# EAGLE design 305_wifi (EAGLE 7.6.0)
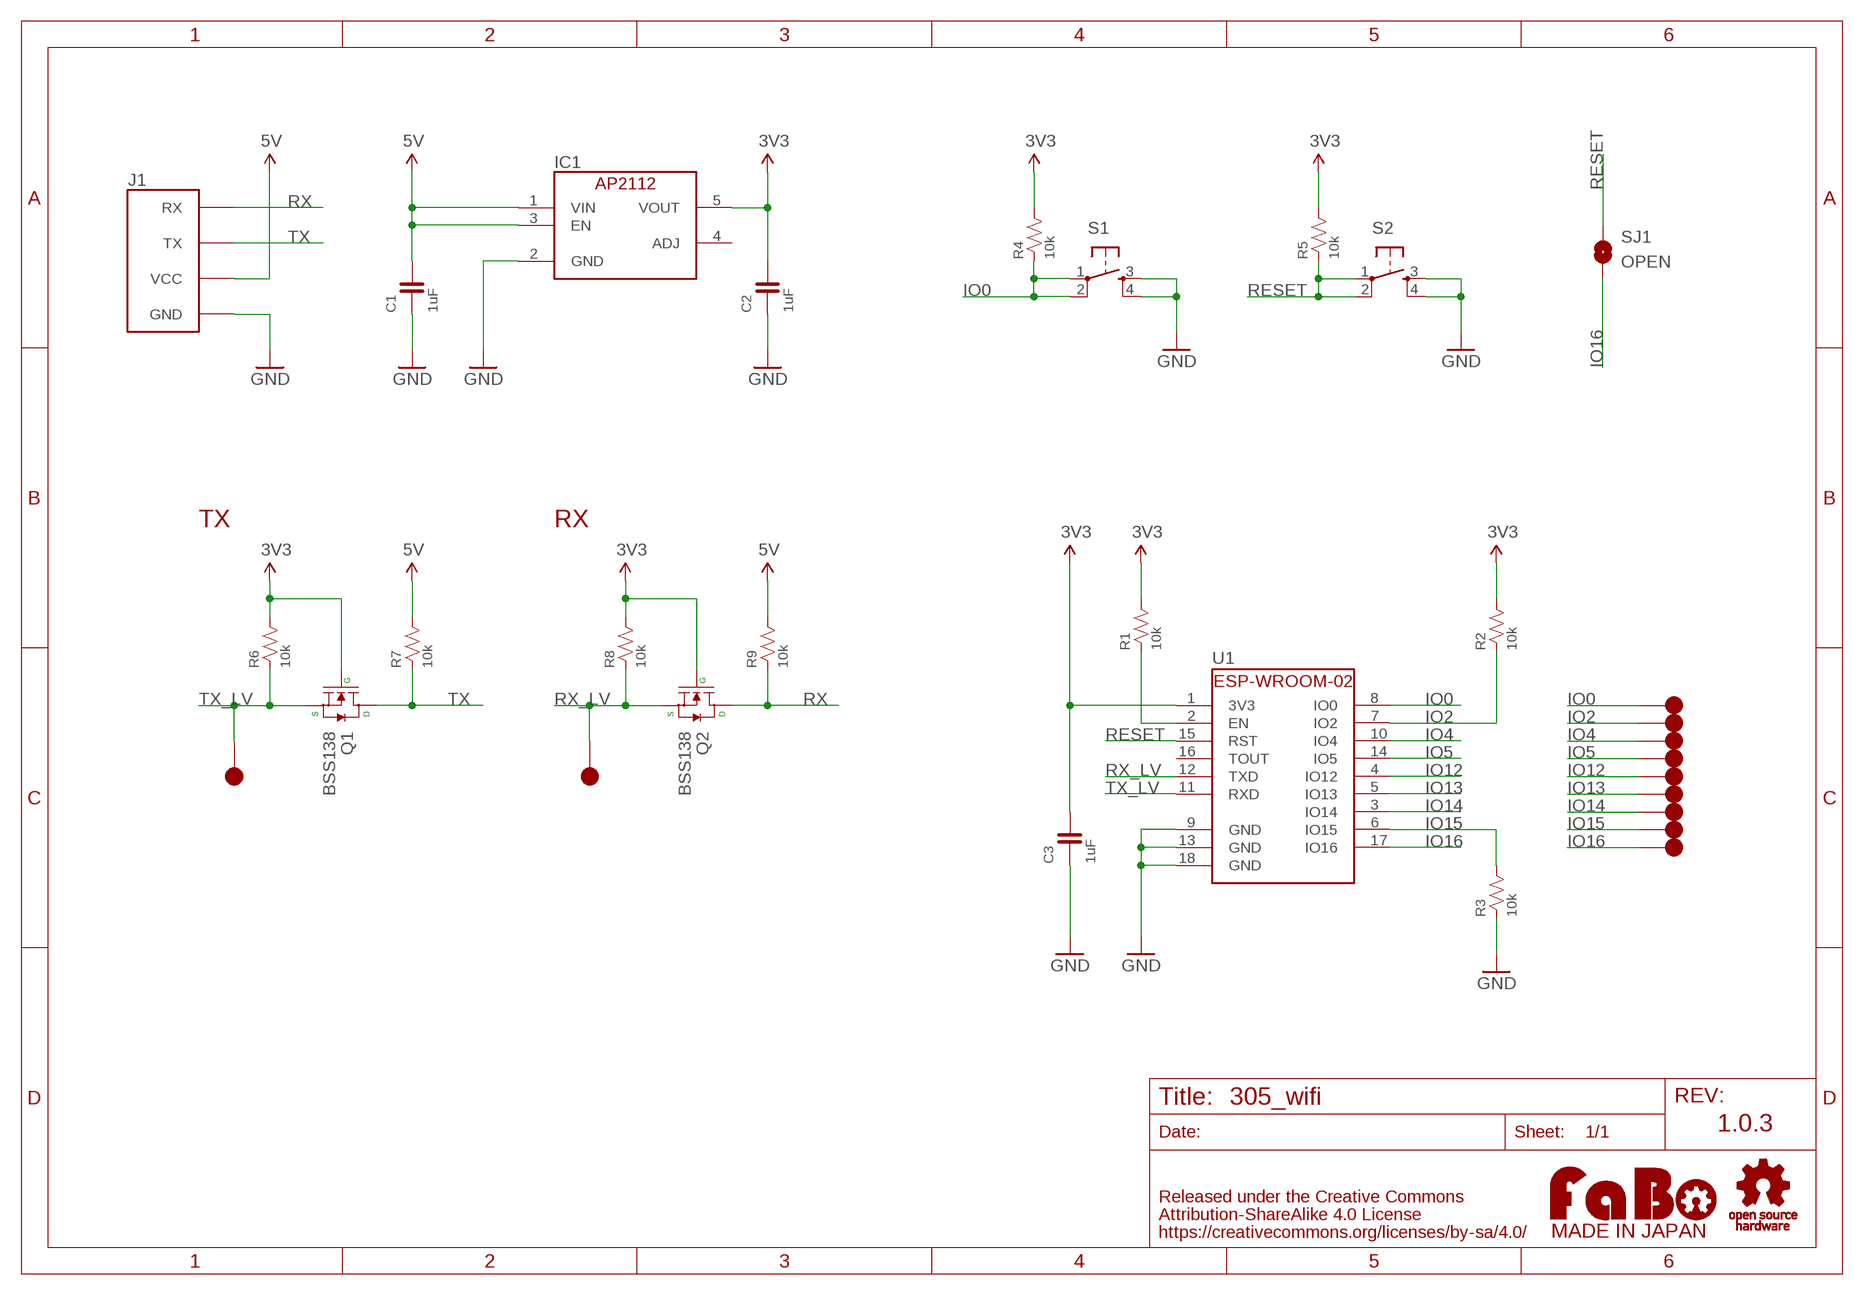
[diagram p0: schematic, sheet 1]

## Parts
C1  1uF  CAPACITOR-0603  [0603]
C2  1uF  CAPACITOR-0603  [0603]
C3  1uF  CAPACITOR-0603  [0603]
IC1  AP2112K-3.3TRG1  [SOT-23-5]
J1  FABO_BRICK_SERIAL-2_HOLE  [FABO_BRICK_SERIAL_2HOLE]
Q1  BSS138  MOSFET-N-BSS138  [SOT23-3]
Q2  BSS138  MOSFET-N-BSS138  [SOT23-3]
R1  10k  RESISTOR-0603  [0603]
R2  10k  RESISTOR-0603  [0603]
R3  10k  RESISTOR-0603  [0603]
R4  10k  RESISTOR-0603  [0603]
R5  10k  RESISTOR-0603  [0603]
R6  10k  RESISTOR-0603-NARROW  [0603-NARROW]
R7  10k  RESISTOR-0603-NARROW  [0603-NARROW]
R8  10k  RESISTOR-0603-NARROW  [0603-NARROW]
R9  10k  RESISTOR-0603-NARROW  [0603-NARROW]
S1  TACT-SWITCH-SMD_KMR2  [KMR2]
S2  TACT-SWITCH-SMD_KMR2  [KMR2]
SJ1  OPEN  SMD-JUMPER-2-OPEN  [SMD-JUMPER-2-OPEN]
TP1  TP-15  [TP-15]
TP2  TP-15  [TP-15]
TP3  TP-15  [TP-15]
TP4  TP-15  [TP-15]
TP5  TP-15  [TP-15]
TP6  TP-15  [TP-15]
TP7  TP-15  [TP-15]
TP8  TP-15  [TP-15]
TP9  TP-15  [TP-15]
TP10  TP-15  [TP-15]
TP11  TP-15  [TP-15]
U1  ES-ESPWROOM02  [ES-ESPWROOM02]
U$1  LOGO_OSHW-M_BOTTOM  [LOGO_OSHW_M_BOTTOM]
U$3  LOGO_FABO-M_BOTTOM  [LOGO_FABO_MS_BOTTOM]

## Nets
3V3: C2.2 C3.2 IC1.5(VOUT) Q1.1(G) Q2.1(G) R1.2 R2.2 R4.2 R5.2 R6.2 R8.2 U1.1(3V3)
5V: C1.2 IC1.1(VIN) IC1.3(EN) J1.VCC R7.2 R9.2
EN: R1.1 U1.2(EN)
GND: C1.1 C2.1 C3.1 IC1.2(GND) J1.GND R3.1 S1.3 S1.4 S2.3 S2.4 U1.9(GND) U1.13(GND) U1.18(GND)
IO0: R4.1 S1.1 S1.2 TP1.1 U1.8(IO0)
IO2: R2.1 TP2.1 U1.7(IO2)
IO4: TP3.1 U1.10(IO4)
IO5: TP4.1 U1.14(IO5)
IO12: TP5.1 U1.4(IO12)
IO13: TP6.1 U1.5(IO13)
IO14: TP7.1 U1.3(IO14)
IO15: R3.2 TP8.1 U1.6(IO15)
IO16: SJ1.2 TP9.1 U1.17(IO16)
RESET: R5.1 S2.1 S2.2 SJ1.1 U1.15(RST)
RX: J1.RX Q2.3(D) R9.1
RX_LV: Q2.2(S) R8.1 TP10.1 U1.12(TXD)
TX: J1.TX Q1.3(D) R7.1
TX_LV: Q1.2(S) R6.1 TP11.1 U1.11(RXD)
Unconnected: IC1.4(ADJ) U1.16(TOUT)

## Notes on the sheet
- TX | RX
- 1.0.3

## Library data of the parts
C1-C3 = FaBo-Capacitor:CAPACITOR: CAPACITOR
IC1 = FaBo-Supply:AP2112
J1 = FaBo-Template:FABO_BRICK_SERIAL: FaBo Brick Serial
Q1 Q2 = FaBo-etc:MOSFET-N
R1-R9 = FaBo-Resistors:RESISTOR: RESISTOR
S1 S2 = FaBo-Switch:TACT-SWITCH
SJ1 = FaBo-Supply:SMD-JUMPER-2
TP1-TP11 = FaBo-Supply:TP
U1 = FaBo-Wifi:ES-ESPWROOM02
U$1 = FaBo-etc:LOGO_OSHW
U$3 = FaBo-etc:LOGO_FABO

## Board
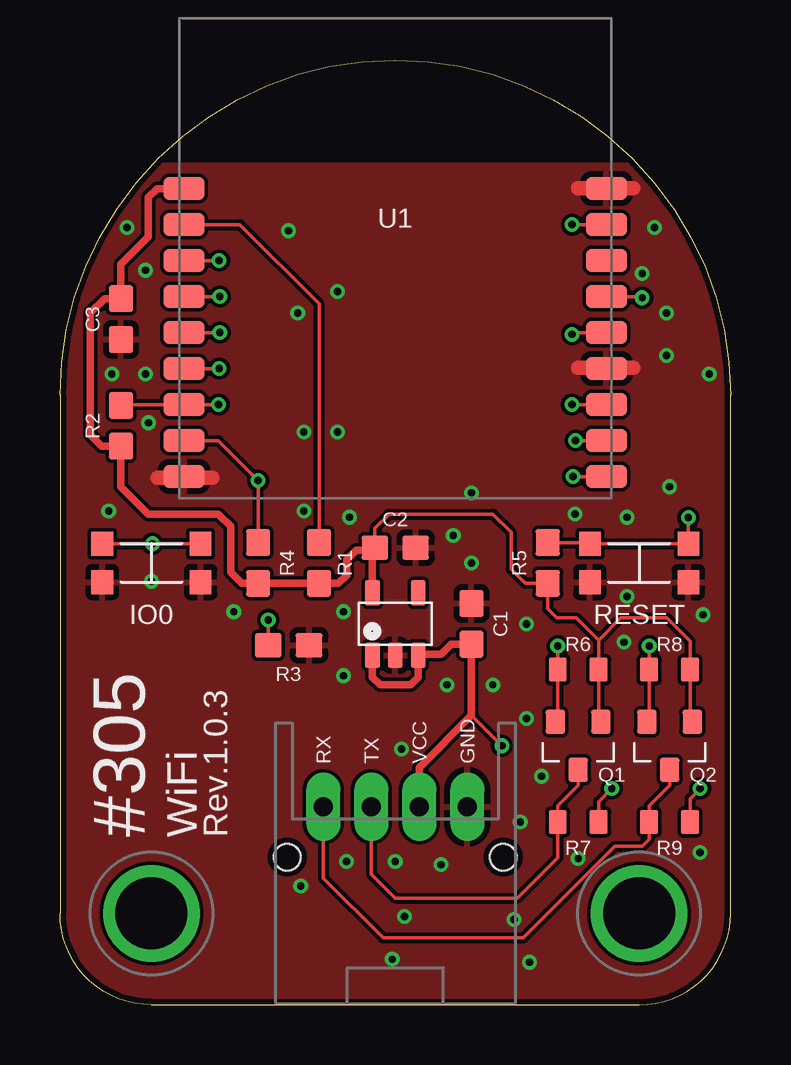
[diagram p1: board, top side]
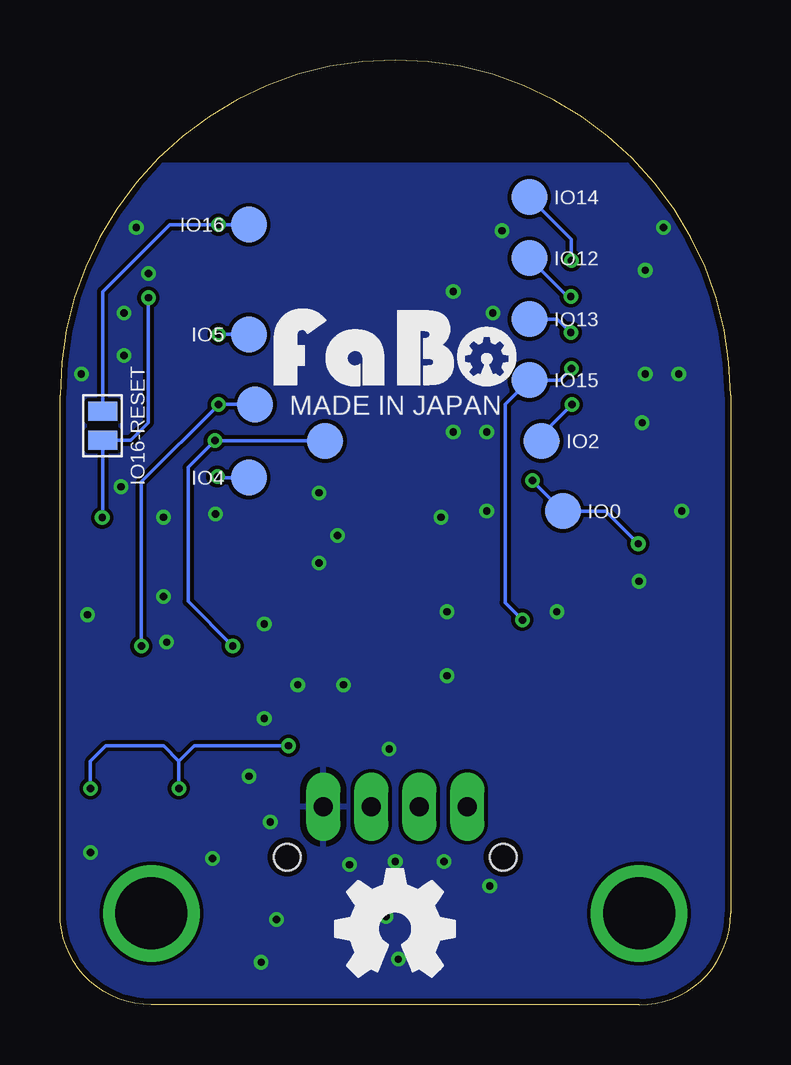
[diagram p2: board, bottom side, seen from below]

Size 27.94 x 39.37 mm. Coordinates in mm from the lower left corner, seen from the top.
Copper layers (1*16): Top 0.035mm / dielectric 1.5mm / Bottom 0.035mm
Design rules "SeeedStudio_2layer_DRU_no_angle_20140221": minimum track width 6mil, minimum drill 12mil, track to track 6mil, track to pad 6mil, pad to pad 6mil, via to via 6mil, smd to smd 0mil, copper to edge 10mil, drill to drill 10mil, minimum pad ring 10mil, minimum via ring 6mil, stop-mask expansion 2mil, vias tented up to drill 100mil, thermal gap 10mil

### Footprints (pad centres in the part's own frame; a part is rotated, then mirrored left to right if it is on the bottom)
0603 = smd 1.1 x 1: 1 -0.85,0; 2 0.85,0
SOT-23-5 = smd 0.6 x 1.05: 1 -0.95,-1.3; 2 0,-1.3; 3 0.95,-1.3; 4 0.95,1.3; 5 -0.95,1.3
FABO_BRICK_SERIAL_2HOLE = drill 0.8 pad 1.422 long: GND 3,-10.795; RX -3,-10.795; TX -1,-10.795; VCC 1,-10.795 | drill 3 pad 3.81: P$1 -10.16,-15.24; P$2 10.16,-15.24 | hole 1.1: -4.5,-12.895; 4.5,-12.895
SOT23-3 = smd 0.8 x 1: 1 -0.95,-1; 2 0.95,-1; 3 0,1
0603-NARROW = smd 0.75 x 1: 1 -0.85,0; 2 0.85,0
KMR2 = smd 0.9 x 1: 1 -2.05,0.8; 2 2.05,0.8; 3 2.05,-0.8; 4 -2.05,-0.8
SMD-JUMPER-2-OPEN = smd 0.8 x 1.2: 1 -0.6,0; 2 0.6,0
TP-15 = smd 1.5 x 1.5: 1 0,0
ES-ESPWROOM02 = smd 1.7 x 0.95: 1 -8.8,2.9; 2 -8.8,1.4; 3 -8.8,-0.1; 4 -8.8,-1.6; 5 -8.8,-3.1; 6 -8.8,-4.6; 7 -8.8,-6.1; 8 -8.8,-7.6; 9 -8.8,-9.1; 10 8.8,-9.1; 11 8.8,-7.6; 12 8.8,-6.1; 13 8.8,-4.6; 14 8.8,-3.1; 15 8.8,-1.6; 16 8.8,-0.1; 17 8.8,1.4; 18 8.8,2.9

### Placement (x,y rotation side)
C1  17.14,15.88 270 top
C2  13.97,19.05 180 top
C3  2.54,28.57 90 top
IC1  13.97,15.88 0 top
J1  13.97,19.05 0 top
Q1  21.59,10.79 180 top
Q2  25.4,10.79 180 top
R1  10.79,18.41 270 top
R2  2.54,24.13 270 top
R3  9.53,14.99 180 top
R4  8.26,18.41 270 top
R5  20.32,18.41 270 top
R6  21.59,13.97 0 top
R7  21.59,7.62 0 top
R8  25.4,13.97 0 top
R9  25.4,7.62 0 top
S1  3.81,18.41 0 top
S2  24.13,18.41 0 top
SJ1  26.16,24.13 90 bottom
TP1  6.99,20.57 0 bottom
TP2  7.87,23.5 0 bottom
TP3  20.07,21.97 0 bottom
TP4  20.07,27.94 0 bottom
TP5  8.38,31.11 0 bottom
TP6  8.38,28.57 0 bottom
TP7  8.38,33.66 0 bottom
TP8  8.38,26.04 0 bottom
TP9  20.07,32.51 0 bottom
TP10  19.81,25.02 0 bottom
TP11  16.89,23.5 0 bottom
U1  13.97,31.11 0 top
U$1  13.97,3.17 0 top
U$3  13.97,25.4 0 top

### Tracks (layer width: path | path; a pad name or v marks a point on that pad's centre or on a via)
3V3
  Top 0.152: C2.2 13.12,19.85 13.72,20.45 18.03,20.45 18.8,19.68 18.8,18.16 19.39,17.57 R5.2 20.32,16.51 20.7,16.13 21.51,16.13 22.44,15.2 | Q1.1 22.44,11.89 R6.2 22.44,15.2 | Q2.1 26.25,11.89 R8.2 26.25,15.15 25.27,16.13 23.37,16.13 22.44,15.2
  Top 0.305: 13.02,18.95 12.35,18.95 11.94,18.54 11.94,17.91 11.6,17.57 R1.2 R4.2 7.58,17.57 7.11,18.03 7.11,19.94 6.6,20.45 3.68,20.45 2.54,21.59 R2.2 1.74,23.28 1.27,23.75 1.27,28.83 1.87,29.43 C3.2 2.54,30.86 3.68,32 3.68,33.66 4.04,34.02 U1.1 | IC1.5 13.02,18.95 | 13.02,18.95 C2.2
5V  (via drill 0.3)
  Top 0.152: R9.2 26.25,8.6 v26.67,9.02 | R7.2 22.44,8.47 v22.99,9.02 | 17.14,12.06 v18.41,10.79
  Top 0.305: J1.VCC 14.97,9.89 17.14,12.06 C1.2 16.3,15.03 15.88,14.61 14.95,14.61 IC1.3 14.92,13.65 14.61,13.34 13.34,13.34 13.02,13.65 IC1.1
  Bottom 0.152: v26.67,9.02 26.67,10.16 26.04,10.79 23.62,10.79 22.99,10.16 | v22.99,9.02 22.99,10.16 | v18.41,10.79 22.35,10.79 22.99,10.16
EN
  Top 0.152: R1.1 10.79,29.21 7.49,32.52 U1.2
GND  (via drill 0.3)
  Top 0.61: 6.35,21.97 4.06,21.97 | 23.88,26.54 21.59,26.54 | 23.88,34.04 21.59,34.04
  other vias: 25.27,27.05 24.77,32.38 25.27,28.83 24.26,30.48 3.56,30.61 3.56,26.29 3.68,24.26 2.16,26.29 2.79,32.38 2.03,20.57 17.14,18.41 11.81,16.38 7.24,16.38 12.06,20.32 10.16,20.57 3.81,17.65 16.38,19.56 17.14,21.34 9.91,28.83 10.16,23.88 11.56,23.88 11.56,29.72 9.53,32.26 19.43,15.88 21.46,20.45 23.62,20.32 25.4,21.59 23.62,17.02 26.8,16.26 23.5,15.11 19.43,11.94 16.13,13.34 20.07,9.53 26.67,6.35 19.18,7.62 15.88,5.84 14.22,10.67 11.81,13.72 11.94,5.97 13.97,5.97 10.03,4.95 13.84,1.91 19.56,1.78 18.92,3.56 14.35,3.68 21.59,6.1 18.03,13.34 27.05,26.29
  pour Bottom: 0,0 27.94,0 27.94,39.37 0,39.37
  pour Top: 0,0 27.94,0 27.94,39.37 0,39.37
IO0  (via drill 0.3)
  Top 0.152: R4.1 v8.26,21.84 6.58,23.52 U1.8 | S1.1 v3.85,19.21 S1.2
  Bottom 0.152: v8.26,21.84 TP1.1 5.21,20.57 v3.85,19.21
IO2  (via drill 0.3)
  Top 0.152: R2.1 2.58,25.02 U1.7 v6.61,25.02
  Bottom 0.152: v6.61,25.02 7.87,23.75 TP2.1
IO4  (via drill 0.3)
  Top 0.152: U1.10 v21.38,22.02
  Bottom 0.152: TP3.1 21.34,21.97 v21.38,22.02
IO5  (via drill 0.3)
  Top 0.152: U1.14 21.41,28.02 v21.34,27.94
  Bottom 0.152: TP4.1 v21.34,27.94
IO12  (via drill 0.3)
  Top 0.152: U1.4 v6.66,29.52
  Bottom 0.152: v6.66,29.52 6.78,29.52 TP5.1
IO13  (via drill 0.3)
  Top 0.152: U1.5 v6.66,28.02
  Bottom 0.152: v6.66,28.02 7.22,28.57 TP6.1
IO14  (via drill 0.3)
  Top 0.152: U1.3 v6.63,31.02
  Bottom 0.152: v6.63,31.02 6.63,31.9 TP7.1
IO15  (via drill 0.3)
  Top 0.152: R3.2 v8.68,16.04 | U1.6 v6.63,26.52
  Bottom 0.152: v8.68,16.04 9.4,16.76 9.4,25.02 TP8.1 7.11,26.04 v6.63,26.52
IO16  (via drill 0.3)
  Top 0.152: U1.17 v21.34,32.52 v21.34,32.51
  Bottom 0.152: SJ1.2 26.16,29.72 23.37,32.51 v21.34,32.51 TP9.1
RESET  (via drill 0.3)
  Top 0.152: R5.1 22.03,19.27 S2.1 S2.2 v26.18,20.3 | U1.15 24.21,29.52 v24.26,29.46
  Bottom 0.152: v24.26,29.46 24.26,24.26 24.98,23.53 SJ1.1 26.16,20.32 v26.18,20.3
RX
  Top 0.152: J1.RX 10.97,5.29 13.46,2.79 19.3,2.79 23.11,6.6 24.26,6.6 24.55,6.9 R9.1 24.55,8.29 25.4,9.14 Q2.3
RX_LV  (via drill 0.3)
  Top 0.152: U1.12 v21.33,25.02 | v24.55,14.95 R8.1 24.55,11.89 Q2.2
  Bottom 0.152: v24.55,14.95 24.55,21.8 v21.33,25.02 TP10.1
TX
  Top 0.152: J1.TX 12.97,5.45 13.97,4.45 19.05,4.45 20.74,6.13 R7.1 20.74,8.29 21.59,9.14 Q1.3
TX_LV  (via drill 0.3)
  Top 0.152: Q1.2 20.74,11.89 R6.1 v20.74,14.95 | U1.11 v21.48,23.52
  Bottom 0.152: v20.74,14.95 22.61,16.81 22.61,22.39 v21.48,23.52 16.91,23.52 TP11.1

### Text on the board
tPlace: IO0 | RESET | #305 | WiFi | Rev.1.0.3
bPlace: IO14 | IO16 | IO12 | IO13 | IO5 | IO15 | MADE IN JAPAN | IO16-RESET | IO2 | IO4 | IO0